# Altium project CreationByte_DevBoard_v1.PrjPcb (part 1 of 2)
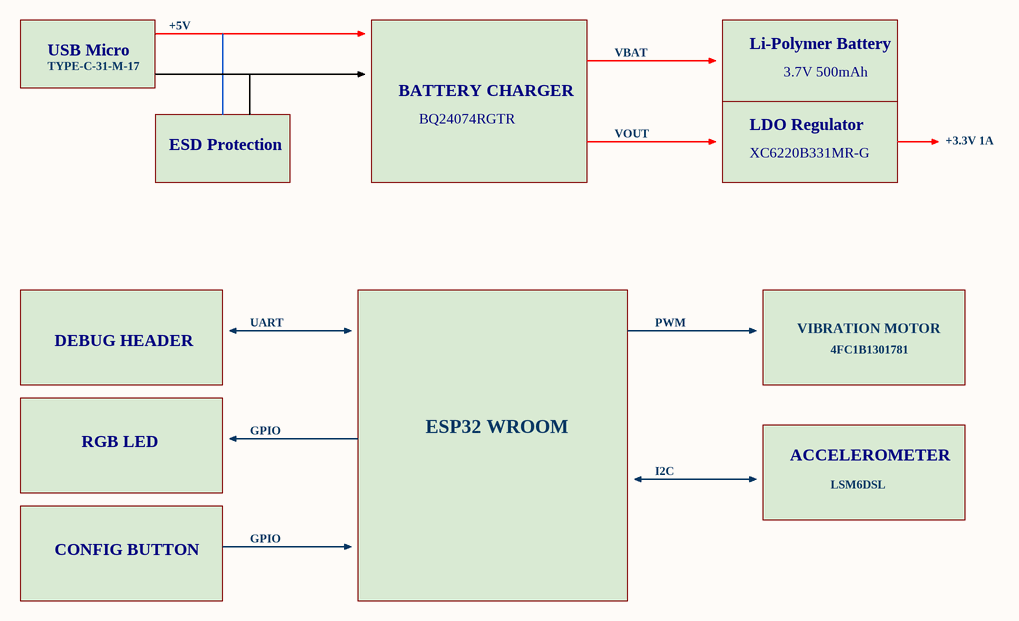
[diagram p0: Block Diagram.SchDoc]
3 sheets, 72 parts. Net scope: flat (ports and power ports of the same name join across sheets).
Board file: CreationByte_DevBoard_v1 PCB.PcbDoc
Sheets:
  Block Diagram.SchDoc
  Power Supply.SchDoc
  ESP32.SchDoc

## Sheet Block Diagram.SchDoc: Block Diagram
size A4; DrawnBy: Manh Ngo Van; Engineer: Manh Ngo Van; Organization: Altium Limited; Address1: L3, 12a Rodborough Rd; Address2: Frenchs Forest; Address3: NSW; Address4: Australia 2086; DocumentNumber: 1; Revision: 1.0; SheetNumber: 1; SheetTotal: 3

### Notes on the sheet
- USB Micro
- TYPE-C-31-M-17
- +5V
- VBAT
- Li-Polymer Battery
- BATTERY CHARGER
- BQ24074RGTR
- VOUT
- LDO Regulator
- 3.7V 500mAh
- +3.3V 1A
- ESD Protection
- XC6220B331MR-G
- UART
- PWM
- VIBRATION MOTOR
- DEBUG HEADER
- 4FC1B1301781
- RGB LED
- GPIO
- ESP32 WROOM
- I2C
- ACCELEROMETER
- LSM6DSL
- CONFIG BUTTON
- Address: 90 Nguyen Tuan Street, Thanh Xuan
- Hanoi - Vietnam
- Title:
- Size
- Document Number:
- Engineer:
- Drawn By:
- Rev:
- Date:
- A4
- Sheet
- of

## Sheet Power Supply.SchDoc: Power Supply
size A4; DrawnBy: Manh Ngo Van; Engineer: Manh Ngo Van; Organization: Altium Limited; Address1: L3, 12a Rodborough Rd; Address2: Frenchs Forest; Address3: NSW; Address4: Australia 2086; DocumentNumber: 2; Revision: 1.0; SheetNumber: 2; SheetTotal: 3
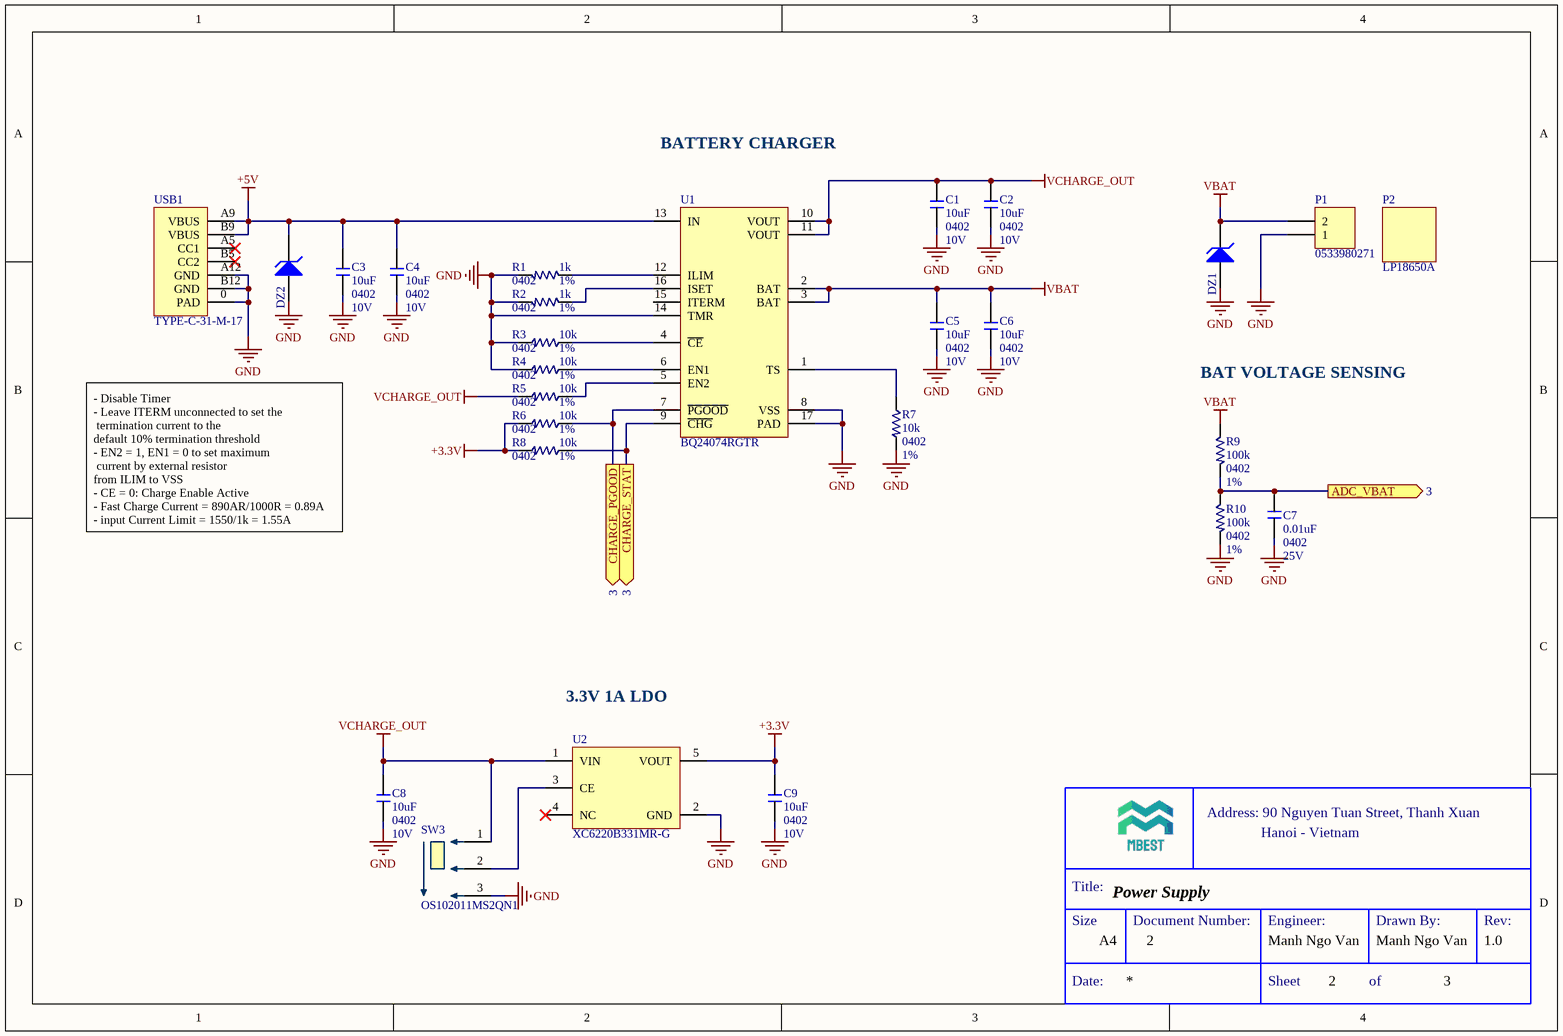
[diagram p1: Power Supply.SchDoc]

### Parts
C1  10uF  Case/Package: 0402  Voltage Rating: 10V  [C0402M]
C2  10uF  Case/Package: 0402  Voltage Rating: 10V  [C0402M]
C3  10uF  Case/Package: 0402  Voltage Rating: 10V  [C0402M]
C4  10uF  Case/Package: 0402  Voltage Rating: 10V  [C0402M]
C5  10uF  Case/Package: 0402  Voltage Rating: 10V  [C0402M]
C6  10uF  Case/Package: 0402  Voltage Rating: 10V  [C0402M]
C7  0.01uF  Case/Package: 0402  Voltage Rating: 25V  [C0402M]
C8  10uF  Case/Package: 0402  Voltage Rating: 10V  [C0402M]
C9  10uF  Case/Package: 0402  Voltage Rating: 10V  [C0402M]
DZ1  TPD1E10B06DPYR  [R0402M]  (value not drawn)
DZ2  TPD1E10B06DPYR  [R0402M]  (value not drawn)
P1  0533980271  [0533980271]  (no BOM)
P2  LP18650A  (mechanical)
R1  1k  Case/Package: 0402  Tolerance: 1%  [R0402M]
R2  1k  Case/Package: 0402  Tolerance: 1%  [R0402M]
R3  10k  Case Code (Imperial): 0402  Tolerance: 1%  [R0402M]
R4  10k  Case Code (Imperial): 0402  Tolerance: 1%  [R0402M]
R5  10k  Case Code (Imperial): 0402  Tolerance: 1%  [R0402M]
R6  10k  Case Code (Imperial): 0402  Tolerance: 1%  [R0402M]
R7  10k  Case Code (Imperial): 0402  Tolerance: 1%  [R0402M]
R8  10k  Case Code (Imperial): 0402  Tolerance: 1%  [R0402M]
R9  100k  Case/Package: 0402  Tolerance: 1%  [R0402M]
R10  100k  Case/Package: 0402  Tolerance: 1%  [R0402M]
SW3  OS102011MS2QN1  [OS102011MS2QN1]
U1  BQ24074RGTR  [QFN50P300X300X100_HS-17N]
U2  XC6220B331MR-G  [SOT95P280X145-5NP]
USB1  TYPE-C-31-M-17  [TYPE-C-31-M-17]

### Ports
ADC_VBAT (out, see 3), CHARGE_PGOOD (out, see 3), CHARGE_STAT (out, see 3)

### Nets
+3.3V: C9.2 R6.1 R8.1 U2.5(VOUT)
+5V: C3.2 C4.2 DZ2.2(K) U1.13(IN) USB1.A9(VBUS) USB1.B9(VBUS)
GND: C1.1 C2.1 C3.1 C4.1 C5.1 C6.1 C7.1 C8.1 C9.1 DZ1.1(A) DZ2.1(A) P1.1 R1.1 R2.1 R3.1 R4.1 R7.1 R10.1 SW3.3 U1.8(VSS) U1.14(TMR) U1.17(PAD) U2.2(GND) USB1.0(PAD) USB1.A12(GND) USB1.B12(GND)
VBAT: C5.2 C6.2 DZ1.2(K) P1.2 R9.2 U1.2(BAT) U1.3(BAT)
VCHARGE_OUT: C1.2 C2.2 C8.2 R5.1 SW3.1 U1.10(VOUT) U1.11(VOUT) U2.1(VIN)
ADC_VBAT: C7.2 R9.1 R10.2 ; port ADC_VBAT
CHARGE_PGOOD: R6.2 U1.7(~{PGOOD}) ; port CHARGE_PGOOD
CHARGE_STAT: R8.2 U1.9(~{CHG}) ; port CHARGE_STAT
NetR1_2: R1.2 U1.12(ILIM)
NetR2_2: R2.2 U1.16(ISET)
NetR3_2: R3.2 U1.4(~{CE})
NetR4_2: R4.2 U1.6(EN1)
NetR5_2: R5.2 U1.5(EN2)
NetR7_2: R7.2 U1.1(TS)
NetSW3_2: SW3.2 U2.3(CE)

Not connected (* = marked no-connect by the designer): U1 15(ITERM); U2 4(NC)*; USB1 A5(CC1)* B5(CC2)*

### Notes on the sheet
- BATTERY CHARGER
- BAT VOLTAGE SENSING
- - Disable Timer
  - Leave ITERM unconnected to set the
  termination current to the
  default 10% termination threshold
  - EN2 = 1, EN1 = 0 to set maximum
  current by external resistor
  from ILIM to VSS
  - CE = 0: Charge Enable Active
  - Fast Charge Current = 890AR/1000R = 0.89A
  - input Current Limit = 1550/1k = 1.55A
- 3.3V 1A LDO
- Address: 90 Nguyen Tuan Street, Thanh Xuan
- Hanoi - Vietnam
- Title:
- Size
- Document Number:
- Engineer:
- Drawn By:
- Rev:
- Date:
- A4
- Sheet
- of

### Library data of the parts
C1-C6 C8 C9 = CAP_CER: CAP CER 10UF 10V X5R 0402; Manufacturer 1: Samsung; Manufacturer Part Number 1: CL05A106MP8NUB8; Mouting Technology: SMT; Tolerance: 20%; Pin: 2; Supplier 1: Digi-Key; Supplier Part Number 1: 1276-6830-6-ND; RoHS: Yes; Category: Ceramic Capacitors; Stock 1: 5372550; Pricing 1: 1=0.37000, 10=0.25800, 50=0.18040, 100=0.15460, 500=0.11598, 1000=0.09793, 2500=0.09278 (USD); Mount: Surface Mount; Case Code (Metric): 1005; Case Code (Imperial): 0402; Min Operating Temperature: -55°C; Max Operating Temperature: 85°C; Packaging: Tape and Reel; Capacitance: 10uF; Length: 0.039inch; Width: 0.02inch; Thickness: 0.035inch; RoHS Compliant: Yes; ComponentLink1URL: http://www.samsungsem.com/kr/support/product-search/mlcc/CL05A106MP8NUB8.jsp?src-supplier=Digi-Key; ComponentLink1Description: http://www.samsungsem.com/kr/support/product-search/mlcc/CL05A106MP8NUB8.jsp?src-supplier=Digi-Key
C7 = CAP_CER: CAP CER 10000PF 25V X7R 0402; Manufacturer: Samsung; Manufacturer Part Number: CL05B103KA5NNNC; Tolerance: 10%; Capacitance: 10nF; ComponentLink1URL: https://datasheet.ciiva.com/11586/upy-gphc-x7r-6-3v-to-50v-8-11586326.pdf?src-supplier=Avnet; ComponentLink1Description: https://datasheet.ciiva.com/11586/upy-gphc-x7r-6-3v-to-50v-8-11586326.pdf?src-supplier=Avnet; ComponentLink2URL: https://datasheet.ciiva.com/17434/upy-gphc-x7r-6-3v-to-50v-8-17434572.pdf?src-supplier=Avnet+Europe; ComponentLink2Description: https://datasheet.ciiva.com/17434/upy-gphc-x7r-6-3v-to-50v-8-17434572.pdf?src-supplier=Avnet+Europe; Supplier 1: Digi-Key; Supplier Part Number 1: 1276-1057-1-ND; Stock 1: 2714388; Pricing 1: 1 = 0.10000, 10 = 0.01800, 50 = 0.00960, 100 = 0.00780, 500 = 0.00558, 1000 = 0.00439, 2500 = 0.00399, 5000 = 0.00367 (USD); RoHS: Yes; Mount: Surface Mount; Case Code (Imperial): 0402; Case Code (Metric): 1005; Contact Plating: Tin; Min Operating Temperature: -55°C; Max Operating Temperature: 125°C; Dielectric: X7R; Packaging: Tape and Reel; Package Quantity: 1; Length: 1mm; Width: 0.02inch; Height: 0.5mm; Thickness: 0.022inch; Depth: 0.5mm; Radiation Hardening: No; ComponentLink3URL: https://datasheet.ciiva.com/15195/getdatasheetpartid-358612-15195635.pdf?src-supplier=Verical; ComponentLink3Description: https://datasheet.ciiva.com/15195/getdatasheetpartid-358612-15195635.pdf?src-supplier=Verical; ComponentLink4URL: https://datasheet.ciiva.com/16740/cl05b104kq5nnnc-16740683.pdf?src-supplier=Future+Electronics; ComponentLink4Description: https://datasheet.ciiva.com/16740/cl05b104kq5nnnc-16740683.pdf?src-supplier=Future+Electronics
DZ1 DZ2 = D Zener: TVS DIODE 5.5V 14V 2X1SON; Manufacturer: Texas Instruments; Capacitance: 12pF; Direction: Bidirectional; Breakdown Voltage: 6V; Number of Channels: 1; Peak Pulse Power: 90W; Power Line Protection: No; Leakage Current: 100nA; ESD Protection: Yes; Test Current: 1mA; Element Configuration: Single; Peak Pulse Current: 5A; Interface: GPIO; Supplier 1: Digi-Key; Supplier Part Number 1: 296-30406-1-ND; Manufacturer Part Number: TPD1E10B06DPYR; Stock 1: 555750; Pricing 1: 1 = 0.45000, 10 = 0.29400, 100 = 0.16380, 500 = 0.10920, 1000 = 0.07560, 5000 = 0.07350 (USD); RoHS: Yes; Case/Package: 0402; Number of Pins: 2; Contact Plating: Gold; Min Operating Temperature: -40°C; Max Operating Temperature: 125°C; Package Quantity: 1; Packaging: Tape and Reel; Number of Bidirectional Channels: 1; Reverse Standoff Voltage: 5.5V; Min Breakdown Voltage: 6V; Clamping Voltage: 14V; Working Voltage: 5.5V; Max Reverse Leakage Current: 100nA; Resistor Type: Zener; Length: 1.1mm; Height: 0.35mm; Width: 0.7mm; Radiation Hardening: No; REACH SVHC: No SVHC; Lead Free: Lead Free; ComponentLink1URL: https://datasheet.ciiva.com/26005/sllseb1b-26005840.pdf?src-supplier=Avnet+Europe; ComponentLink1Description: https://datasheet.ciiva.com/26005/sllseb1b-26005840.pdf?src-supplier=Avnet+Europe; ComponentLink2URL: https://datasheet.ciiva.com/46384/1877100-46384054.pdf?src-supplier=Element14; ComponentLink2Description: https://datasheet.ciiva.com/46384/1877100-46384054.pdf?src-supplier=Element14; ComponentLink3URL: https://datasheet.ciiva.com/14195/tpd1e10b06-14195178.pdf?src-supplier=Avnet; ComponentLink3Description: https://datasheet.ciiva.com/14195/tpd1e10b06-14195178.pdf?src-supplier=Avnet; ComponentLink4URL: https://datasheet.ciiva.com/22691/1877100-22691786.pdf?src-supplier=Element14; ComponentLink4Description: https://datasheet.ciiva.com/22691/1877100-22691786.pdf?src-supplier=Element14; ComponentLink5URL: https://datasheet.ciiva.com/2961/tpd1e10b06-2961245.pdf?src-supplier=Digi-Key; ComponentLink5Description: https://datasheet.ciiva.com/2961/tpd1e10b06-2961245.pdf?src-supplier=Digi-Key; ComponentLink6URL: https://datasheet.ciiva.com/2961/tpd1e10b06-2961246.pdf?src-supplier=Digi-Key; ComponentLink6Description: https://datasheet.ciiva.com/2961/tpd1e10b06-2961246.pdf?src-supplier=Digi-Key; ComponentLink7URL: https://datasheet.ciiva.com/6574/tpd1e10b06-6574654.pdf?src-supplier=Digi-Key; ComponentLink7Description: https://datasheet.ciiva.com/6574/tpd1e10b06-6574654.pdf?src-supplier=Digi-Key
P1 = Header 2: CONN HEADER SMD 2POS 1.25MM; Manufacturer 1: Molex; Manufacturer Part Number 1: 53398-0271; Current Rating: 1A; Voltage Rating (AC): 125V; Contact Resistance: 20mR; Number of Positions: 2; Insulation Resistance: 100MR; Gender: Male; Glow Wire Compliant: Non-compliant; LatestRevisionDate: 17-Jul-2002; LatestRevisionNote: Re-released for DXP Platform.; Publisher: Altium Limited; Supplier 1: Digi-Key; Supplier Part Number 1: WM7606CT-ND; RoHS: Yes; Category: Headers and Wire Housings; Stock 1: 417; Pricing 1: 1=0.53000, 10=0.44900, 100=0.34940 (USD); Mount: Surface Mount; Contact Material: Bronze,Brass,Tin; Contact Plating: Tin; Color: Natural; Housing Color: Natural; Housing Material: Nylon; Min Operating Temperature: -40°C; Max Operating Temperature: 85°C; Number of Rows: 1; Packaging: Tape and Reel; Package Quantity: 1000; Voltage Rating: 125V; Termination: Solder; Number of Contacts: 2; Working Voltage: 125V; Orientation: Vertical; Number of Circuits: 2; Voltage Rating (DC): 125V; Series: PicoBlade; Contact Type: Blade Pin; Pitch: 1.25mm; Depth: 4.2mm; Radiation Hardening: No; RoHS Compliant: Yes; REACH SVHC: Unknown; Lead Free: Lead Free; Flammability Rating: UL94 V-0; ComponentLink1URL: https://datasheet.ciiva.com/7167/1626130-7167520.pdf?src-supplier=Newark; ComponentLink1Description: https://datasheet.ciiva.com/7167/1626130-7167520.pdf?src-supplier=Newark; ComponentLink2URL: https://datasheet.ciiva.com/7920/1841150-7920834.pdf?src-supplier=Element14; ComponentLink2Description: https://datasheet.ciiva.com/7920/1841150-7920834.pdf?src-supplier=Element14; ComponentLink3URL: https://datasheet.ciiva.com/14156/gf116833-116846-e-14156243.pdf?src-supplier=Distrelec; ComponentLink3Description: https://datasheet.ciiva.com/14156/gf116833-116846-e-14156243.pdf?src-supplier=Distrelec; ComponentLink4URL: https://datasheet.ciiva.com/36178/1932619-36178944.pdf?src-supplier=Jameco; ComponentLink4Description: https://datasheet.ciiva.com/36178/1932619-36178944.pdf?src-supplier=Jameco; ComponentLink5URL: https://datasheet.ciiva.com/28523/1759360-28523372.pdf?src-supplier=Element14; ComponentLink5Description: https://datasheet.ciiva.com/28523/1759360-28523372.pdf?src-supplier=Element14; ComponentLink6URL: https://datasheet.ciiva.com/9468/0533980271-pcb-headers-9468512.pdf?src-supplier=Avnet; ComponentLink6Description: https://datasheet.ciiva.com/9468/0533980271-pcb-headers-9468512.pdf?src-supplier=Avnet; ComponentLink7URL: https://datasheet.ciiva.com/30229/225140533980271-pcb-headers-30229043.pdf?src-supplier=Onlinecomponents.com; ComponentLink7Description: https://datasheet.ciiva.com/30229/225140533980271-pcb-headers-30229043.pdf?src-supplier=Onlinecomponents.com; ComponentLink8URL: https://datasheet.ciiva.com/5150/0533980271-pcb-headers-146564-5150549.pdf?src-supplier=Mouser; ComponentLink8Description: https://datasheet.ciiva.com/5150/0533980271-pcb-headers-146564-5150549.pdf?src-supplier=Mouser; ComponentLink9URL: https://datasheet.ciiva.com/11746/0900766b80ab946a-11746463.pdf?src-supplier=RSComponents; ComponentLink9Description: https://datasheet.ciiva.com/11746/0900766b80ab946a-11746463.pdf?src-supplier=RSComponents; ComponentLink10URL: https://datasheet.ciiva.com/22707/1867379-22707654.pdf?src-supplier=Element14; ComponentLink10Description: https://datasheet.ciiva.com/22707/1867379-22707654.pdf?src-supplier=Element14; ComponentLink11URL: https://datasheet.ciiva.com/22683/1626130-22683563.pdf?src-supplier=Element14; ComponentLink11Description: https://datasheet.ciiva.com/22683/1626130-22683563.pdf?src-supplier=Element14; ComponentLink12URL: https://datasheet.ciiva.com/16658/0533980271-pcb-headers-16658429.pdf?src-supplier=Avnet+Europe; ComponentLink12Description: https://datasheet.ciiva.com/16658/0533980271-pcb-headers-16658429.pdf?src-supplier=Avnet+Europe; ComponentLink13URL: https://datasheet.ciiva.com/18454/70090670-18454279.pdf?src-supplier=Allied+Electronics; ComponentLink13Description: https://datasheet.ciiva.com/18454/70090670-18454279.pdf?src-supplier=Allied+Electronics
P2 = ADDITION: 3.7V Rechargeable Lithium-ion Polymer Battery LP18650A+ 3500mAh With PCM and JST Connector; Manufacturer 1: Dongguan Juhe New Energy; Manufacturer Part Number 1: LP18650A; ComponentLink1Description: Link; ComponentLink1URL: https://www.li-polymer-battery.com/3-7v-rechargeable-lithium-ion-polymer-battery-lp18650a-3500mah-with-pcm-and-jst-connector/page/5/?et_blog
R1 R2 = RES_SMD: RES SMD 1K OHM 1% 1/16W 0402; Manufacturer 1: Yageo; Manufacturer Part Number 1: RC0402FR-071KL; Mouting Technology: SMT; Resistance: 1kR; Temperature Coefficient: 100ppm/°C; Voltage Rating (DC): 50V; Power Rating: 62.5mW; Max Power Dissipation: 63mW; Pin: 2; Supplier 1: Digi-Key; Supplier Part Number 1: 311-1.00KLRCT-ND; RoHS: Yes; Category: Chip SMD Resistors; Pricing 1: 1=0.10000, 10=0.01600, 100=0.00660, 1000=0.00299, 2500=0.00259, 5000=0.00214 (USD); Number of Pins: 2; Case Code (Imperial): 0402; Case Code (Metric): 1005; Size Code: 0402; Min Operating Temperature: -55°C; Max Operating Temperature: 155°C; Resistor Type: Thick Film; Packaging: Tape and Reel; Voltage Rating: 50V; Termination: SMD/SMT; Features: Moisture Resistant; Series: RC; Number of Terminations: 2; Resistance Tolerance: 1%; Construction: Rectangular; Technology: THICK FILM; Length: 1mm; Width: 0.5mm; Height: 0.32mm; Depth: 0.5mm; REACH SVHC: Unknown; Lead Free: Lead Free; RoHS Compliant: Yes; Military Standard: Not; ComponentLink1URL: https://datasheet.ciiva.com/11819/0900766b80c66297-11819477.pdf?src-supplier=RSComponents; ComponentLink1Description: https://datasheet.ciiva.com/11819/0900766b80c66297-11819477.pdf?src-supplier=RSComponents; ComponentLink2URL: https://datasheet.ciiva.com/7983/1018594-7983502.pdf?src-supplier=Element14; ComponentLink2Description: https://datasheet.ciiva.com/7983/1018594-7983502.pdf?src-supplier=Element14; ComponentLink3URL: https://datasheet.ciiva.com/22747/1018594-22747513.pdf?src-supplier=Element14; ComponentLink3Description: https://datasheet.ciiva.com/22747/1018594-22747513.pdf?src-supplier=Element14; ComponentLink4URL: https://datasheet.ciiva.com/12666/pyu-rc0402-51-rohs-l-6-r-12666741.pdf?src-supplier=Mouser; ComponentLink4Description: https://datasheet.ciiva.com/12666/pyu-rc0402-51-rohs-l-6-r-12666741.pdf?src-supplier=Mouser; ComponentLink5URL: https://datasheet.ciiva.com/7849/1018594-7849869.pdf?src-supplier=Element14; ComponentLink5Description: https://datasheet.ciiva.com/7849/1018594-7849869.pdf?src-supplier=Element14; ComponentLink6URL: https://datasheet.ciiva.com/7849/1018594-7849871.pdf?src-supplier=Element14; ComponentLink6Description: https://datasheet.ciiva.com/7849/1018594-7849871.pdf?src-supplier=Element14; ComponentLink7URL: https://datasheet.ciiva.com/17063/pyu-rc0402-51-rohs-l-6-r-17063193.pdf?src-supplier=Future+Electronics; ComponentLink7Description: https://datasheet.ciiva.com/17063/pyu-rc0402-51-rohs-l-6-r-17063193.pdf?src-supplier=Future+Electronics
R3-R8 = RES_SMD: RES SMD 10K OHM 1% 1/16W 0402; Manufacturer: Yageo; Manufacturer Part Number: RC0402FR-0710KL; Resistance: 10kR; Temperature Coefficient: 100ppm/°C; Voltage Rating (DC): 50V; Power Rating: 62.5mW; Supplier 1: Digi-Key; Supplier Part Number 1: 311-10.0KLRTR-ND; Stock 1: 58760000; Pricing 1: 10000 = 0.001630, 30000 = 0.001440, 50000 = 0.001320, 100000 = 0.001290 (USD); RoHS: Yes; Case/Package: 0402; Number of Pins: 2; Case Code (Metric): 1005; Min Operating Temperature: -55°C; Max Operating Temperature: 155°C; Composition: Thick Film; Packaging: Tape and Reel; Voltage Rating: 50V; Termination: SMD/SMT; Military Standard: Not; Working Voltage: 50V; Number of Terminations: 2; Length: 1mm; Height: 0.32mm; Width: 0.5mm; Depth: 0.5mm; Lead Pitch: 0.2mm; REACH SVHC: No SVHC; Lead Free: Lead Free; ComponentLink1URL: https://datasheet.ciiva.com/7660/38568-7660787.pdf?src-supplier=Element14; ComponentLink1Description: https://datasheet.ciiva.com/7660/38568-7660787.pdf?src-supplier=Element14; ComponentLink2URL: https://datasheet.ciiva.com/7849/1784430-7849813.pdf?src-supplier=Element14; ComponentLink2Description: https://datasheet.ciiva.com/7849/1784430-7849813.pdf?src-supplier=Element14; ComponentLink3URL: https://datasheet.ciiva.com/7849/1686128-7849814.pdf?src-supplier=Element14; ComponentLink3Description: https://datasheet.ciiva.com/7849/1686128-7849814.pdf?src-supplier=Element14; ComponentLink4URL: https://datasheet.ciiva.com/7849/1784430-7849815.pdf?src-supplier=Element14; ComponentLink4Description: https://datasheet.ciiva.com/7849/1784430-7849815.pdf?src-supplier=Element14; ComponentLink5URL: https://datasheet.ciiva.com/22747/1018594-22747512.pdf?src-supplier=Element14; ComponentLink5Description: https://datasheet.ciiva.com/22747/1018594-22747512.pdf?src-supplier=Element14; ComponentLink6URL: https://datasheet.ciiva.com/12667/pyu-rc0402-51-rohs-l-6-r-12667067.pdf?src-supplier=Mouser; ComponentLink6Description: https://datasheet.ciiva.com/12667/pyu-rc0402-51-rohs-l-6-r-12667067.pdf?src-supplier=Mouser; ComponentLink7URL: https://datasheet.ciiva.com/7983/1018594-7983486.pdf?src-supplier=Element14; ComponentLink7Description: https://datasheet.ciiva.com/7983/1018594-7983486.pdf?src-supplier=Element14
R9 R10 = RES_SMD: RES SMD 100K OHM 1% 1/16W 0402; Manufacturer: Yageo; Manufacturer Part Number: RC0402FR-07100KL; Resistance: 100kR; Power Rating: 63mW; Voltage Rating: 50V; Temperature Coefficient: 100ppm/°C; ComponentLink1URL: https://datasheet.ciiva.com/11808/0900766b80f96399-11808107.pdf?src-supplier=RSComponents; ComponentLink1Description: https://datasheet.ciiva.com/11808/0900766b80f96399-11808107.pdf?src-supplier=RSComponents; ComponentLink2URL: https://datasheet.ciiva.com/7983/443971-7983593.pdf?src-supplier=Element14; ComponentLink2Description: https://datasheet.ciiva.com/7983/443971-7983593.pdf?src-supplier=Element14; ComponentLink3URL: https://datasheet.ciiva.com/46440/1868787-46440889.pdf?src-supplier=Element14; ComponentLink3Description: https://datasheet.ciiva.com/46440/1868787-46440889.pdf?src-supplier=Element14; ComponentLink4URL: https://datasheet.ciiva.com/7746/1738695-7746234.pdf?src-supplier=Element14; ComponentLink4Description: https://datasheet.ciiva.com/7746/1738695-7746234.pdf?src-supplier=Element14; ComponentLink5URL: https://datasheet.ciiva.com/7746/1738695-7746235.pdf?src-supplier=Element14; ComponentLink5Description: https://datasheet.ciiva.com/7746/1738695-7746235.pdf?src-supplier=Element14; ComponentLink6URL: https://datasheet.ciiva.com/22747/443971-22747516.pdf?src-supplier=Element14; ComponentLink6Description: https://datasheet.ciiva.com/22747/443971-22747516.pdf?src-supplier=Element14; Supplier 1: Digi-Key; Supplier Part Number 1: 311-100KJRCT-ND; Stock 1: 3850330; Pricing 1: 1 = 0.10000, 10 = 0.01200, 100 = 0.00480, 1000 = 0.00215, 2500 = 0.00186, 5000 = 0.00154 (USD); RoHS: Yes; Case Code (Metric): 1005; Case Code (Imperial): 0402; Min Operating Temperature: -55°C; Max Operating Temperature: 155°C; Packaging: Tape and Reel; Package Quantity: 1; Resistor Type: Thick Film; Number of Terminations: 2; Termination: SMD/SMT; Max Power Dissipation: 63mW; Features: Moisture Resistant; Length: 1mm; Width: 0.02inch; Height: 0.016inch; Depth: 0.5mm; REACH SVHC: Unknown; Military Standard: Not; Lead Free: Lead Free; ComponentLink7URL: https://datasheet.ciiva.com/7850/1018594-7850133.pdf?src-supplier=Element14; ComponentLink7Description: https://datasheet.ciiva.com/7850/1018594-7850133.pdf?src-supplier=Element14; ComponentLink8URL: https://datasheet.ciiva.com/2491/pyu-r-int-thick-7-2491207.pdf?src-supplier=Digi-Key; ComponentLink8Description: https://datasheet.ciiva.com/2491/pyu-r-int-thick-7-2491207.pdf?src-supplier=Digi-Key; ComponentLink9URL: https://datasheet.ciiva.com/2491/pyu-r-int-thick-7-2491208.pdf?src-supplier=Digi-Key; ComponentLink9Description: https://datasheet.ciiva.com/2491/pyu-r-int-thick-7-2491208.pdf?src-supplier=Digi-Key; ComponentLink10URL: https://datasheet.ciiva.com/2491/pyu-r-int-thick-7-2491209.pdf?src-supplier=Digi-Key; ComponentLink10Description: https://datasheet.ciiva.com/2491/pyu-r-int-thick-7-2491209.pdf?src-supplier=Digi-Key; ComponentLink11URL: https://datasheet.ciiva.com/17052/pyu-rc0402-51-rohs-l-6-r-17052137.pdf?src-supplier=Future+Electronics; ComponentLink11Description: https://datasheet.ciiva.com/17052/pyu-rc0402-51-rohs-l-6-r-17052137.pdf?src-supplier=Future+Electronics; ComponentLink12URL: https://datasheet.ciiva.com/12668/pyu-rc0402-51-rohs-l-6-r-12668218.pdf?src-supplier=Mouser; ComponentLink12Description: https://datasheet.ciiva.com/12668/pyu-rc0402-51-rohs-l-6-r-12668218.pdf?src-supplier=Mouser; ComponentLink13URL: https://datasheet.ciiva.com/46394/1018594-46394941.pdf?src-supplier=Element14; ComponentLink13Description: https://datasheet.ciiva.com/46394/1018594-46394941.pdf?src-supplier=Element14
SW3 = JS202011JAQN: Slide; Manufacturer 1: ITT C&K; Mechanical Life: 10000Cycles; Actuator Material: Polyoxymethylene,Acetal,Polyacetal; Actuator Color: Black; Throw Configuration: SPDT; Max Voltage Rating (DC): 12V; Max Current Rating: 100mA; Contact Resistance: 20mR; Contact Style: Non-Shorting; Insulation Resistance: 100MR; Switch Travel: 2mm; Switch Function: On-On; Actuator Type: Standard; Actuator Length: 4mm; Supplier 1: Digi-Key; Supplier Part Number 1: CKN9565-ND; Manufacturer Part Number 1: OS102011MS2QN1; RoHS: Yes; Category: Slide Switches; Stock 1: 34195; Pricing 1: 1=0.51000, 10=0.49300, 25=0.47520, 100=0.41110, 250=0.37452, 500=0.34712, 1000=0.31059, 2500=0.29415, 5000=0.27222 (USD); Mount: Through Hole,PCB; Contact Material: Copper Alloy,Brass,Silver; Contact Plating: Silver,Gold; Housing Material: Resin; Min Operating Temperature: -30°C; Max Operating Temperature: 70°C; Termination: PC Pins; Packaging: Bulk; Electrical Life: 10000Cycles; Orientation: Vertical; Voltage Rating (DC): 12V; Package Quantity: 300; Contact Current Rating: 100mA; Current Rating: 100mA; Series: OS; Length: 8.6mm; Depth: 4.3mm; Radiation Hardening: No; REACH SVHC: No SVHC; RoHS Compliant: Yes; Lead Free: Lead Free; ComponentLink1URL: https://datasheet.ciiva.com/30466/0900766b81263f61-30466806.pdf?src-supplier=RSComponents; ComponentLink1Description: https://datasheet.ciiva.com/30466/0900766b81263f61-30466806.pdf?src-supplier=RSComponents; ComponentLink2URL: https://datasheet.ciiva.com/16298/os102011ms2qn1-16298526.pdf?src-supplier=Future+Electronics; ComponentLink2Description: https://datasheet.ciiva.com/16298/os102011ms2qn1-16298526.pdf?src-supplier=Future+Electronics; ComponentLink3URL: https://datasheet.ciiva.com/2889/os-19jan15-2889173.pdf?src-supplier=Digi-Key; ComponentLink3Description: https://datasheet.ciiva.com/2889/os-19jan15-2889173.pdf?src-supplier=Digi-Key; ComponentLink4URL: https://datasheet.ciiva.com/1699/os-19jan15-1699479.pdf?src-supplier=Newark; ComponentLink4Description: https://datasheet.ciiva.com/1699/os-19jan15-1699479.pdf?src-supplier=Newark; ComponentLink5URL: https://datasheet.ciiva.com/18147/getdatasheetpartid-320490-18147210.pdf?src-supplier=Verical; ComponentLink5Description: https://datasheet.ciiva.com/18147/getdatasheetpartid-320490-18147210.pdf?src-supplier=Verical; ComponentLink6URL: https://datasheet.ciiva.com/16997/70128245-16997771.pdf?src-supplier=Allied+Electronics; ComponentLink6Description: https://datasheet.ciiva.com/16997/70128245-16997771.pdf?src-supplier=Allied+Electronics; ComponentLink7URL: https://datasheet.ciiva.com/26290/os-11mar13-26290652.pdf?src-supplier=Onlinecomponents.com; ComponentLink7Description: https://datasheet.ciiva.com/26290/os-11mar13-26290652.pdf?src-supplier=Onlinecomponents.com; ComponentLink8URL: https://datasheet.ciiva.com/1532/1683358-1532308.pdf?src-supplier=Element14; ComponentLink8Description: https://datasheet.ciiva.com/1532/1683358-1532308.pdf?src-supplier=Element14
U1 = BQ24074RGTR: IC BATT CHG LI-ION 1CELL 16QFN; Manufacturer 1: Texas Instruments; Output Voltage: 4.2V; Output Current: 1.5A; Max Supply Voltage: 10.2V; Min Supply Voltage: 4.35V; Min Input Voltage: 4.3V; Number of Cells: 1; Interface: USB; Fault Protection: Over Voltage,Over Temperature,Short Circuit,Reverse Current; Battery Chemistry: LITHIUM-ION; Supplier 1: Mouser; Manufacturer Part Number 1: BQ24074RGTR; RoHS: Yes; Category: Battery Management; Stock 1: 15; Pricing 1: 1=2.29000, 10=2.07000, 50=1.95000, 100=1.66000, 1000=1.13000, 10000=1.06000 (USD); Case/Package: VQFN; Number of Pins: 16; Weight: 0.000808oz; Contact Plating: Gold; Min Operating Temperature: -40°C; Max Operating Temperature: 125°C; Packaging: Tape and Reel; Package Quantity: 3000; Series: -; Max Charge Current: 1.5A; Battery Pack Voltage: 4.2V; Radiation Hardening: No; Lead Free: Lead Free; RoHS Compliant: Yes; ComponentLink1URL: https://datasheet.ciiva.com/1932/bq24074-1932360.pdf?src-supplier=Digi-Key; ComponentLink1Description: https://datasheet.ciiva.com/1932/bq24074-1932360.pdf?src-supplier=Digi-Key; ComponentLink2URL: https://datasheet.ciiva.com/26811/getdatasheetpartid-357714-26811766.pdf?src-supplier=Verical; ComponentLink2Description: https://datasheet.ciiva.com/26811/getdatasheetpartid-357714-26811766.pdf?src-supplier=Verical; ComponentLink3URL: https://datasheet.ciiva.com/3214/bq24079-3214039.pdf?src-supplier=Avnet; ComponentLink3Description: https://datasheet.ciiva.com/3214/bq24079-3214039.pdf?src-supplier=Avnet; ComponentLink4URL: https://datasheet.ciiva.com/26109/bq24079-26109321.pdf?src-supplier=Avnet+Europe; ComponentLink4Description: https://datasheet.ciiva.com/26109/bq24079-26109321.pdf?src-supplier=Avnet+Europe; Supplier Part Number 1: 595-BQ24074RGTR
U2 = XC6220B331MR-G: IC REG LINEAR 3.3V 1A SOT25; Manufacturer: Torex; Dropout Voltage: 655mV; Min Input Voltage: 1.6V; Max Input Voltage: 6V; Number of Regulators: 1; Min Current Limit: 1.005A; Output Type: Fixed; Supplier 1: Digi-Key; Manufacturer Part Number: XC6220B331MR-G; Stock 1: 13360; Pricing 1: 1 = 0.91000, 10 = 0.81100, 25 = 0.77000, 100 = 0.59130, 250 = 0.52252, 500 = 0.49500, 1000 = 0.38500 (USD); RoHS: Yes; Mount: Surface Mount; Case/Package: SOT-25; Number of Pins: 5; Min Operating Temperature: -40°C; Max Operating Temperature: 85°C; Package Quantity: 1; Packaging: Tape and Reel; Output Current: 1A; Output Voltage: 3.3V; Nominal Output Voltage: 3.3V; REACH SVHC: No SVHC; ComponentLink1URL: https://datasheet.ciiva.com/2040/xc6220-2040200.pdf?src-supplier=Digi-Key; ComponentLink1Description: https://datasheet.ciiva.com/2040/xc6220-2040200.pdf?src-supplier=Digi-Key; ComponentLink2URL: https://datasheet.ciiva.com/2040/xc6220-2040201.pdf?src-supplier=Digi-Key; ComponentLink2Description: https://datasheet.ciiva.com/2040/xc6220-2040201.pdf?src-supplier=Digi-Key; ComponentLink3URL: https://datasheet.ciiva.com/2040/xc6220-2040202.pdf?src-supplier=Digi-Key; ComponentLink3Description: https://datasheet.ciiva.com/2040/xc6220-2040202.pdf?src-supplier=Digi-Key; ComponentLink4URL: https://datasheet.ciiva.com/7992/610888-7992813.pdf?src-supplier=Element14; ComponentLink4Description: https://datasheet.ciiva.com/7992/610888-7992813.pdf?src-supplier=Element14; ComponentLink5URL: https://datasheet.ciiva.com/5755/610888-5755886.pdf?src-supplier=Farnell; ComponentLink5Description: https://datasheet.ciiva.com/5755/610888-5755886.pdf?src-supplier=Farnell; Supplier Part Number 1: 893-1133-1-ND
USB1 = TYPE-C-31-M-17: USB - Type C Female 6 USB Connectors RoHS; Manufacturer 1: Korean Hroparts Elec; Manufacturer Part Number 1: TYPE-C-31-M-17

## Sheet ESP32.SchDoc: WiFi Bluetooth and Peripheral
size A3; DrawnBy: Manh Ngo Van; Engineer: Manh Ngo Van; Organization: Altium Limited; Address1: L3, 12a Rodborough Rd; Address2: Frenchs Forest; Address3: NSW; Address4: Australia 2086; DocumentNumber: 3; Revision: 1.0; SheetNumber: 3; SheetTotal: 3
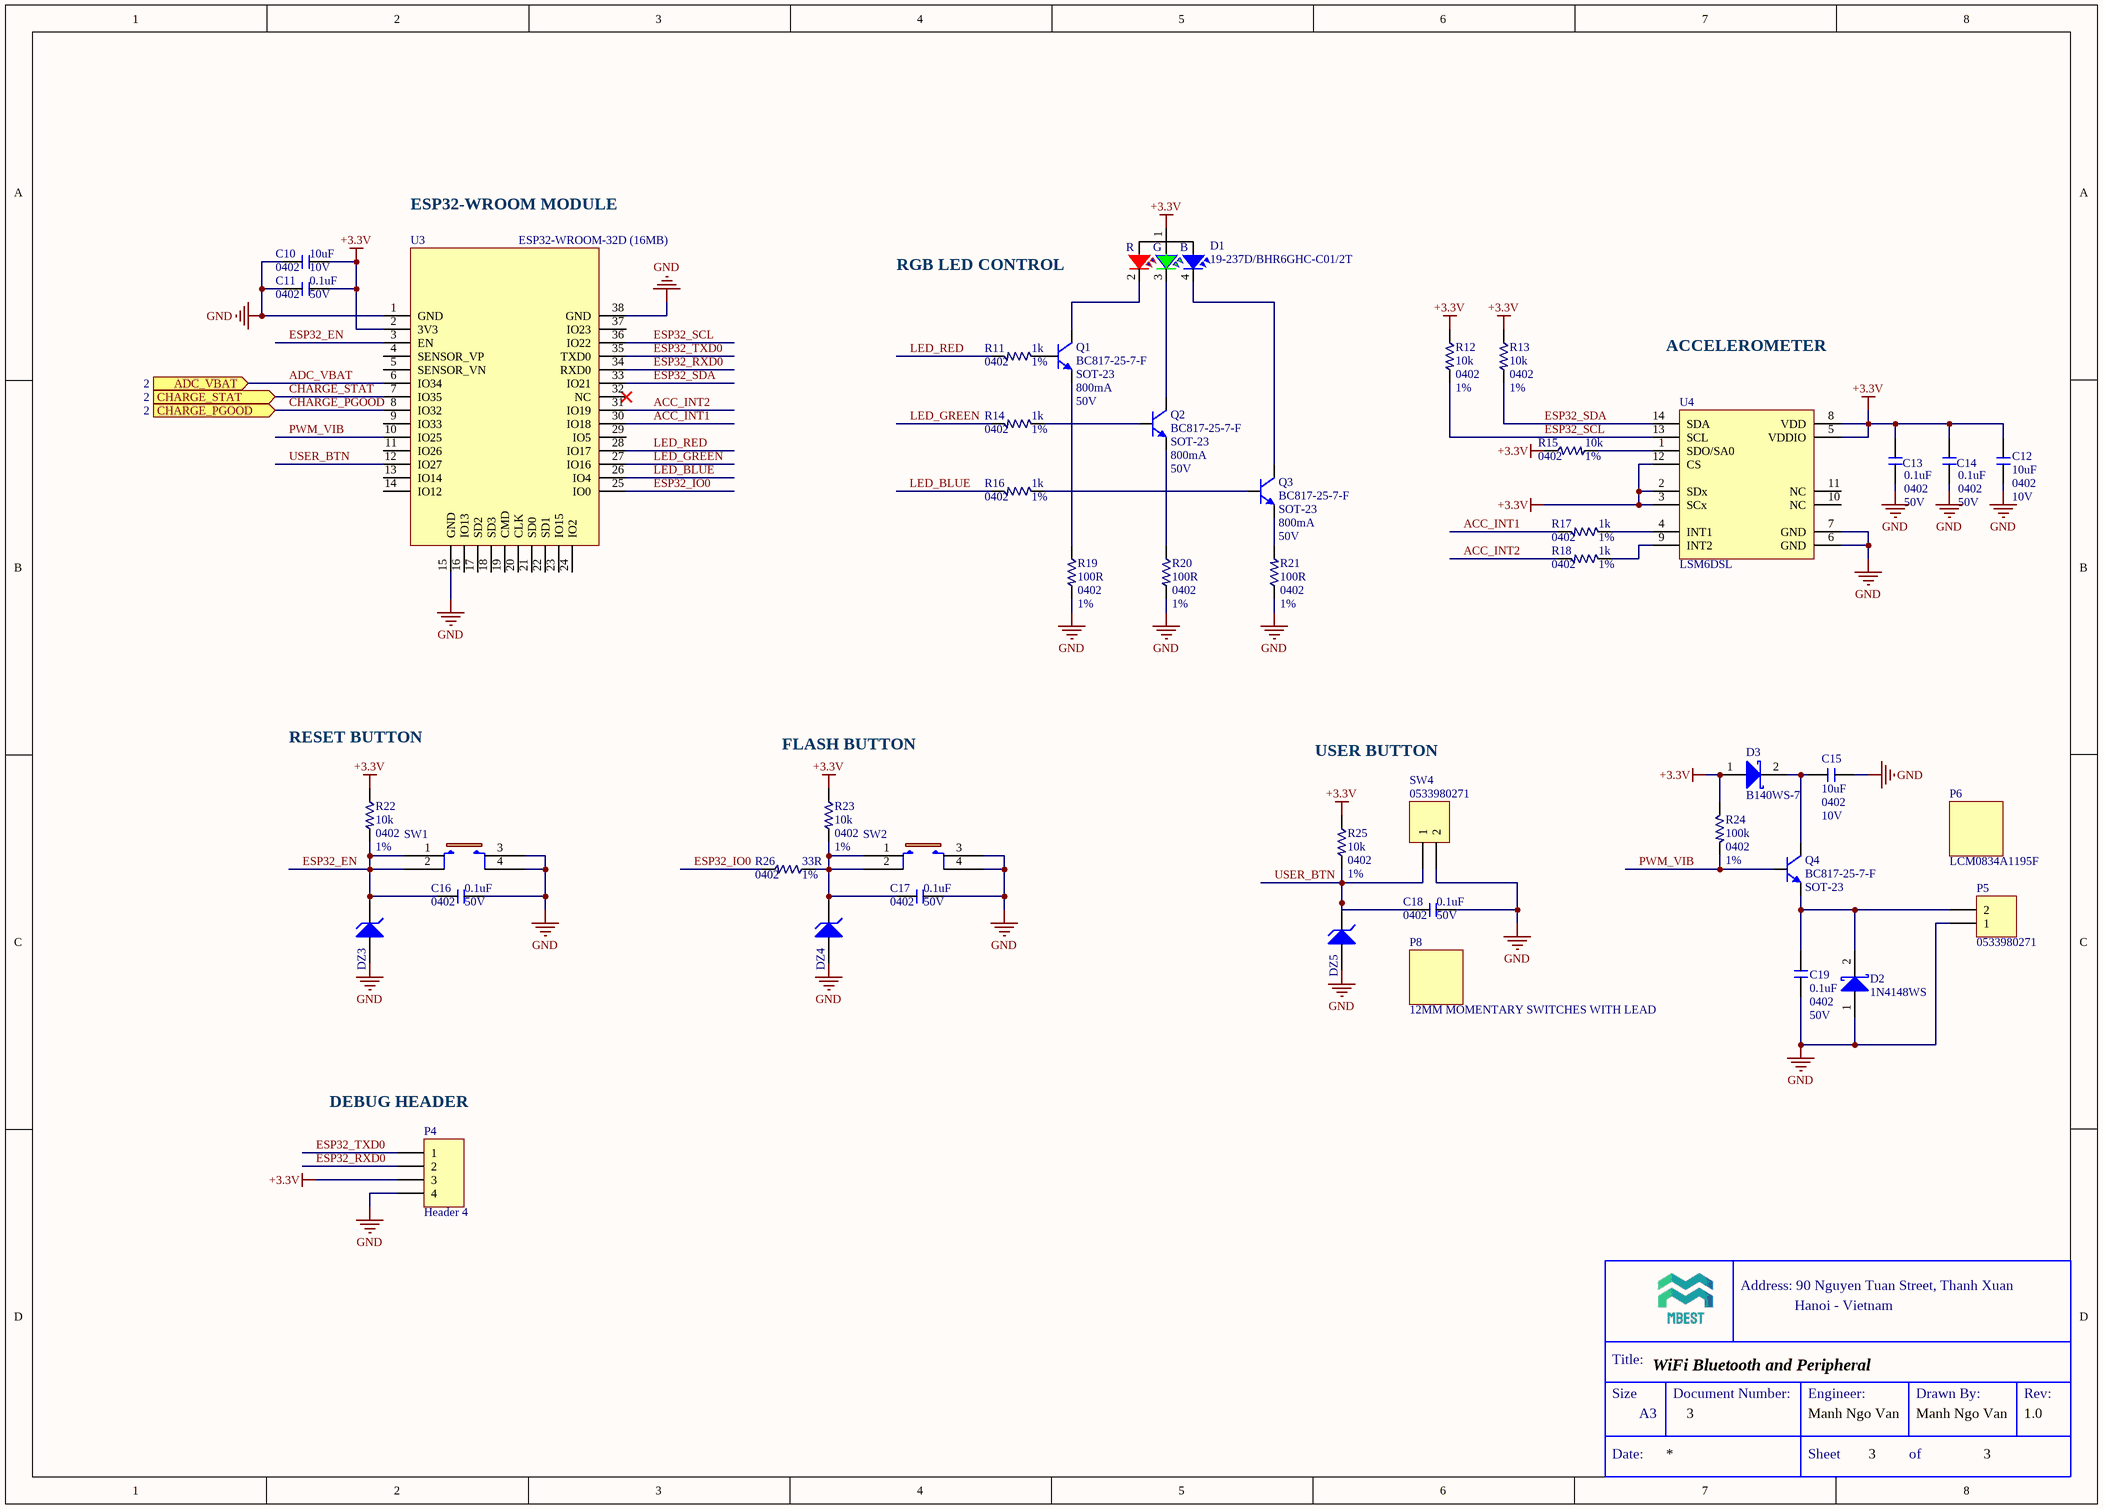
[diagram p2: ESP32.SchDoc]

### Parts
C10  10uF  Case/Package: 0402  Voltage Rating: 10V  [C0402M]
C11  0.1uF  Case/Package: 0402  Voltage: 50V  [C0402M]
C12  10uF  Case/Package: 0402  Voltage Rating: 10V  [C0402M]
C13  0.1uF  Case/Package: 0402  Voltage: 50V  [C0402M]
C14  0.1uF  Case/Package: 0402  Voltage: 50V  [C0402M]
C15  10uF  Case/Package: 0402  Voltage Rating: 10V  [C0402M]
C16  0.1uF  Case/Package: 0402  Voltage: 50V  [C0402M]
C17  0.1uF  Case/Package: 0402  Voltage: 50V  [C0402M]
C18  0.1uF  Case/Package: 0402  Voltage: 50V  [C0402M]
C19  0.1uF  Case/Package: 0402  Voltage: 50V  [C0402M]
D1  19-237D/BHR6GHC-C01/2T  [19-237D/BHR6GHC-C01/2T]
D2  1N4148WS  [SODFL250X70-2N]
D3  B140WS-7  [SODFL250X70-2N]
DZ3  TPD1E10B06DPYR  [R0402M]  (value not drawn)
DZ4  TPD1E10B06DPYR  [R0402M]  (value not drawn)
DZ5  TPD1E10B06DPYR  [R0402M]  (value not drawn)
P4  Header 4  [HDR1X4]
P5  0533980271  [0533980271]  (no BOM)
P6  LCM0834A1195F  (mechanical)
P8  12MM MOMENTARY SWITCHES WITH LEAD  (mechanical)
Q1  BC817-25-7-F  Case/Package: SOT-23  Max Collector Current: 800mA  Collector Base Voltage (VCBO): 50V  [SOT95P245X110-3N]
Q2  BC817-25-7-F  Case/Package: SOT-23  Max Collector Current: 800mA  Collector Base Voltage (VCBO): 50V  [SOT95P245X110-3N]
Q3  BC817-25-7-F  Case/Package: SOT-23  Max Collector Current: 800mA  Collector Base Voltage (VCBO): 50V  [SOT95P245X110-3N]
Q4  BC817-25-7-F  Case/Package: SOT-23  [SOT95P245X110-3N]
R11  1k  Case/Package: 0402  Tolerance: 1%  [R0402M]
R12  10k  Case Code (Imperial): 0402  Tolerance: 1%  [R0402M]
R13  10k  Case Code (Imperial): 0402  Tolerance: 1%  [R0402M]
R14  1k  Case/Package: 0402  Tolerance: 1%  [R0402M]
R15  10k  Case Code (Imperial): 0402  Tolerance: 1%  [R0402M]
R16  1k  Case/Package: 0402  Tolerance: 1%  [R0402M]
R17  1k  Case/Package: 0402  Tolerance: 1%  [R0402M]
R18  1k  Case/Package: 0402  Tolerance: 1%  [R0402M]
R19  100R  Case Code (Imperial): 0402  Tolerance: 1%  [R0402M]
R20  100R  Case Code (Imperial): 0402  Tolerance: 1%  [R0402M]
R21  100R  Case Code (Imperial): 0402  Tolerance: 1%  [R0402M]
R22  10k  Case Code (Imperial): 0402  Tolerance: 1%  [R0402M]
R23  10k  Case Code (Imperial): 0402  Tolerance: 1%  [R0402M]
R24  100k  Case/Package: 0402  Tolerance: 1%  [R0402M]
R25  10k  Case Code (Imperial): 0402  Tolerance: 1%  [R0402M]
R26  33R  Size Code: 0402  Tolerance: 1%  [R0402M]
SW1  PTS810SJK250SMTRLFS  [PTS810SJG250SMTRLFS]  (value not drawn)
SW2  PTS810SJK250SMTRLFS  [PTS810SJG250SMTRLFS]  (value not drawn)
SW4  0533980271  [0533980271]  (no BOM)
U3  ESP32-WROOM-32D (16MB)  [ESP32S]
U4  LSM6DSL  [LSM6DSL]

### Ports
ADC_VBAT (in, see 2), CHARGE_PGOOD (in, see 2), CHARGE_STAT (in, see 2)

### Nets
+3.3V: C10.2 C11.2 C12.2 C13.2 C14.2 D1.1(ANODE) D3.1(A) P4.3 R12.2 R13.2 R15.2 R22.2 R23.2 R24.2 R25.2 U3.2(3V3) U4.2(SDx) U4.3(SCx) U4.5(VDDIO) U4.8(VDD) U4.12(CS)
GND: C10.1 C11.1 C12.1 C13.1 C14.1 C15.1 C16.2 C17.2 C18.2 C19.1 D2.1(A) DZ3.1(A) DZ4.1(A) DZ5.1(A) P4.4 P5.1 R19.1 R20.1 R21.2 SW1.3 SW1.4 SW2.3 SW2.4 SW4.2 U3.1(GND) U3.15(GND) U3.38(GND) U4.6(GND) U4.7(GND)
ACC_INT1: R17.1 U3.30(IO18)
ACC_INT2: R18.1 U3.31(IO19)
ADC_VBAT: U3.6(IO34) ; port ADC_VBAT
CHARGE_PGOOD: U3.8(IO32) ; port CHARGE_PGOOD
CHARGE_STAT: U3.7(IO35) ; port CHARGE_STAT
ESP32_EN: C16.1 DZ3.2(K) R22.1 SW1.1 SW1.2 U3.3(EN)
ESP32_IO0: R26.1 U3.25(IO0)
ESP32_RXD0: P4.2 U3.34(RXD0)
ESP32_SCL: R12.1 U3.36(IO22) U4.13(SCL)
ESP32_SDA: R13.1 U3.33(IO21) U4.14(SDA)
ESP32_TXD0: P4.1 U3.35(TXD0)
LED_BLUE: R16.1 U3.26(IO4)
LED_GREEN: R14.1 U3.27(IO16)
LED_RED: R11.1 U3.28(IO17)
PWM_VIB: Q4.1(B) R24.1 U3.10(IO25)
USER_BTN: C18.1 DZ5.2(K) R25.1 SW4.1 U3.12(IO27)
NetC15_2: C15.2 D3.2(K) Q4.3(C)
NetC17_1: C17.1 DZ4.2(K) R23.1 R26.2 SW2.1 SW2.2
NetC19_2: C19.2 D2.2(K) P5.2 Q4.2(E)
NetD1_2: D1.2(R) Q1.3(C)
NetD1_3: D1.3(G) Q2.3(C)
NetD1_4: D1.4(B) Q3.3(C)
NetQ1_1: Q1.1(B) R11.2
NetQ1_2: Q1.2(E) R19.2
NetQ2_1: Q2.1(B) R14.2
NetQ2_2: Q2.2(E) R20.2
NetQ3_1: Q3.1(B) R16.2
NetQ3_2: Q3.2(E) R21.1
NetR15_1: R15.1 U4.1(SDO/SA0)
NetR17_2: R17.2 U4.4(INT1)
NetR18_2: R18.2 U4.9(INT2)

Not connected (* = marked no-connect by the designer): U3 4(SENSOR_VP) 5(SENSOR_VN) 9(IO33) 11(IO26) 13(IO14) 14(IO12) 16(IO13) 17(SD2) 18(SD3) 19(CMD) 20(CLK) 21(SD0) 22(SD1) 23(IO15) 24(IO2) 29(IO5) 32(NC)* 37(IO23); U4 10(NC) 11(NC)

### Notes on the sheet
- ESP32-WROOM MODULE
- RGB LED CONTROL
- ACCELEROMETER
- RESET BUTTON
- (near R23) FLASH BUTTON
- USER BUTTON
- (near P4) DEBUG HEADER
- Address: 90 Nguyen Tuan Street, Thanh Xuan
- Hanoi - Vietnam
- Title:
- Size
- Document Number:
- Engineer:
- Drawn By:
- Rev:
- Date:
- A3
- Sheet
- of